# EAGLE design IR_tester_light (EAGLE 7.7.0)
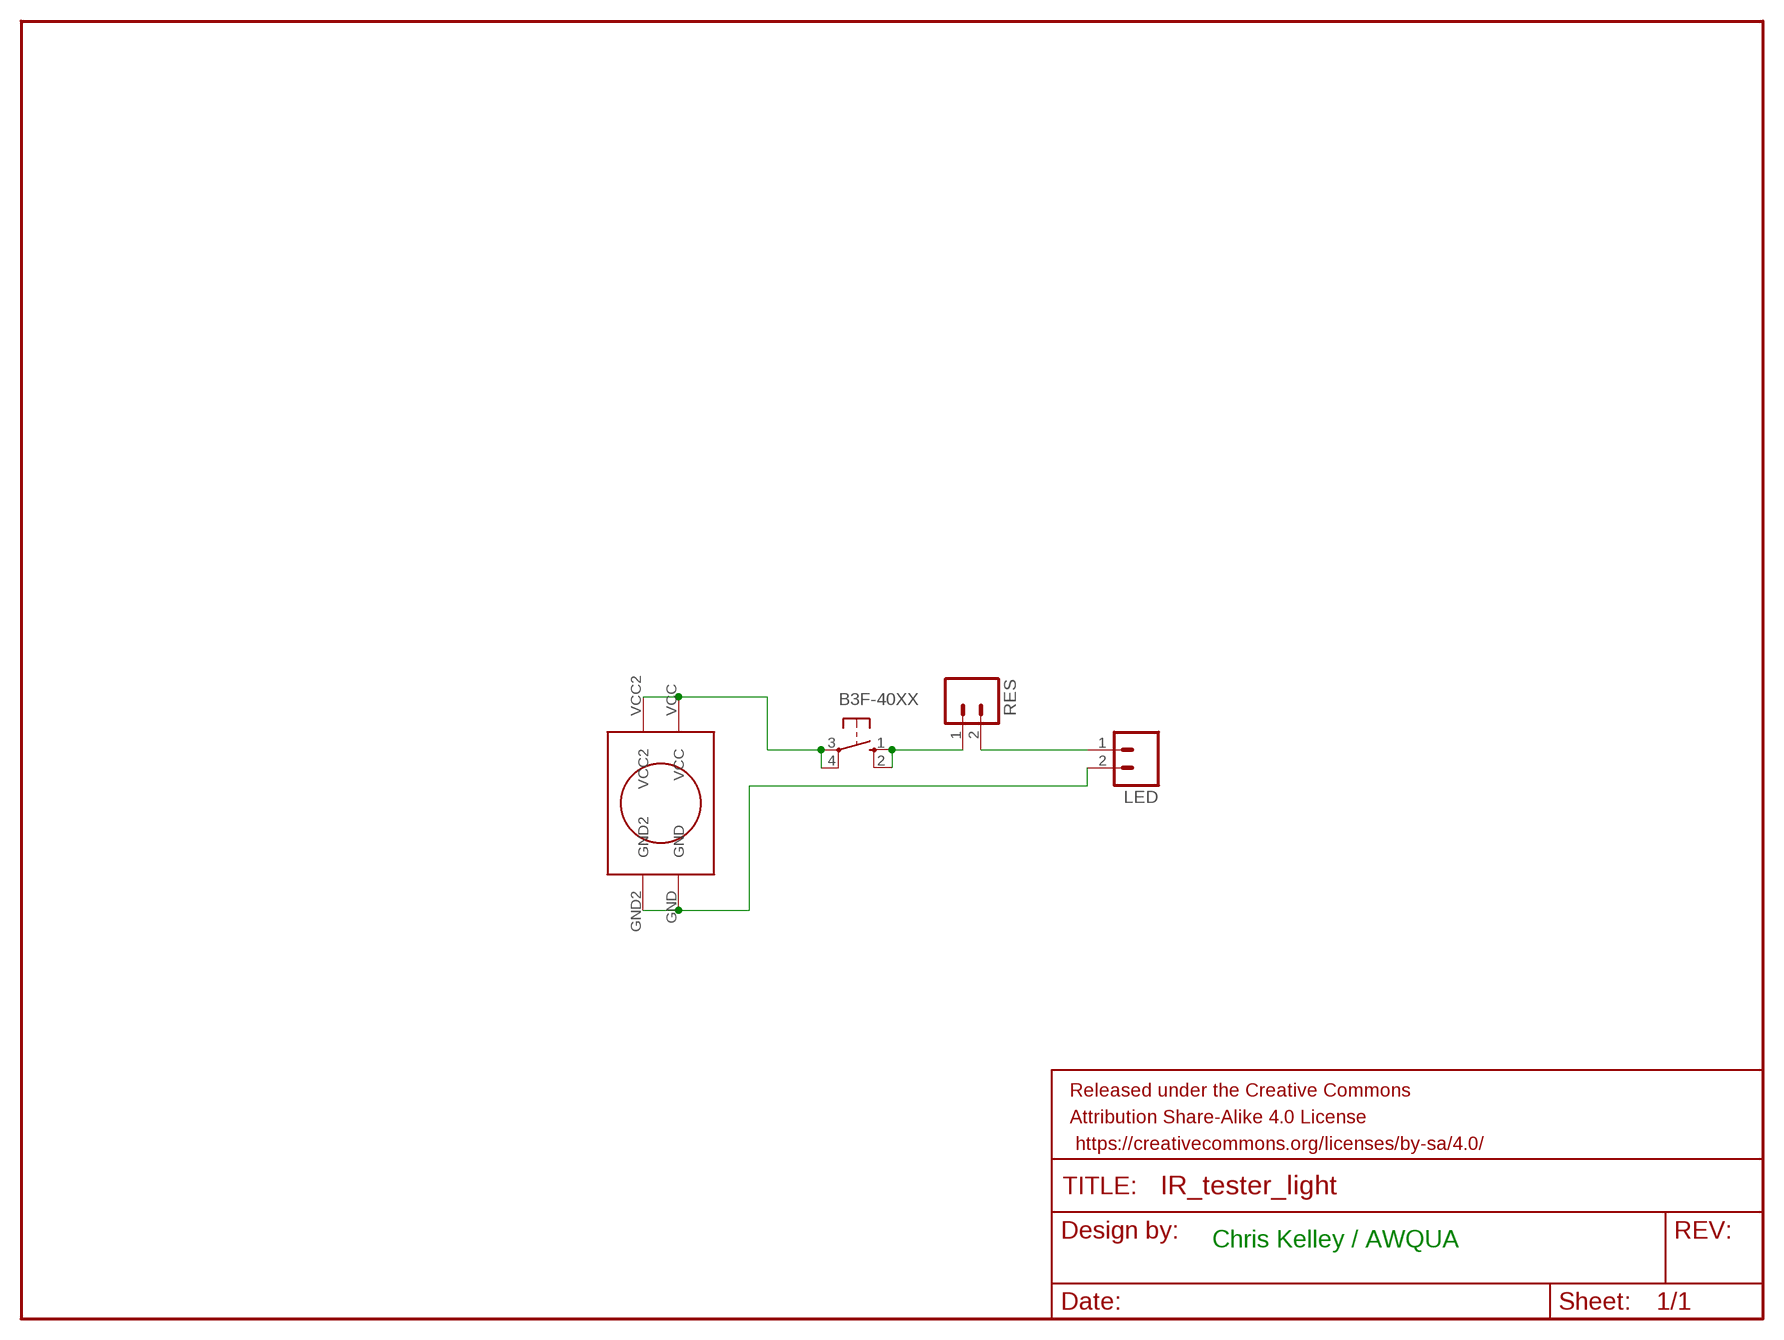
[diagram p0: schematic, sheet 1]

## Parts
B3F-40XX  40-XX  [B3F-40XX]
FRAME1  FRAME-LETTER  [CREATIVE_COMMONS]
LED  M02PTH  [1X02]
RES  M02PTH  [1X02]
U$1  CR1632-KEYSTYONE-3013  [CR1632-KEYSTYONE-3013]

## Nets
GND: LED.2 U$1.GND U$1.GND2
N$10: LED.1 RES.2
N$11: B3F-40XX.1(S) B3F-40XX.2(S1) RES.1
VCC: B3F-40XX.3(P) B3F-40XX.4(P1) U$1.VCC U$1.VCC2

## Notes on the sheet
- Chris Kelley / AWQUA

## Library data of the parts
B3F-40XX = adafruit:40-XX: OMRON SWITCH; MF: OMRON COMPONENTS USA; MPN: B3F-4000; OC_FARNELL: 176434; OC_NEWARK: 36K3105
FRAME1 = SparkFun-Aesthetics:FRAME-LETTER: Schematic Frame Standard 8.5x11 US Letter frame
LED RES = SparkFun-Connectors:M02: Standard 2-pin 0.1" header. Use with - straight break away headers ( PRT-00116) - right angle break away headers (PRT-00553) - swiss pins (PRT-00743) - machine pins (PRT-00117) - female headers (PRT-00115) Molex polarized connector foot print use with: PRT-08233 with associated crimp pins and housings. 2.54_SCREWTERM for use with PRT-10571. 3.5mm Screw Terminal footprints for PRT-08084 5mm Screw Terminal footprints for use with PRT-08432
U$1 = awqua_eagle_library:CR1632-KEYSTYONE-3013

## Board
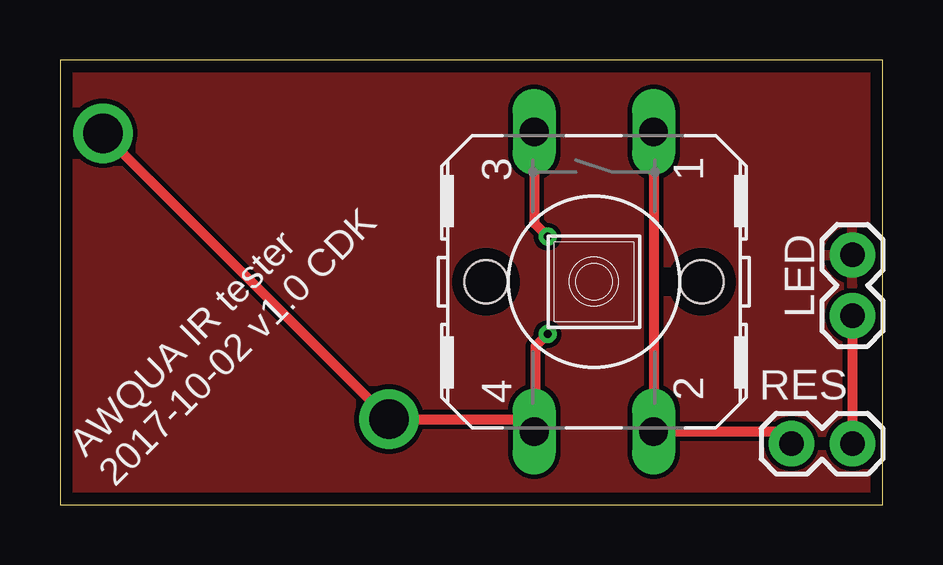
[diagram p1: board, top side]
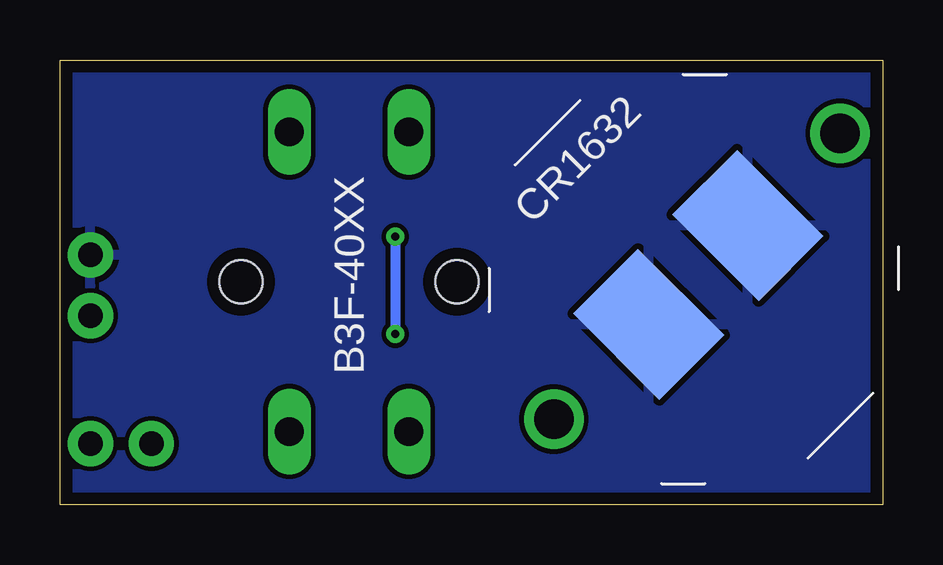
[diagram p2: board, bottom side, seen from below]

Size 34.29 x 18.54 mm. Coordinates in mm from the lower left corner, seen from the top.
Outline: 0,18.54 0,0 34.29,0 34.29,18.54 0,18.54
Copper layers (1*16): Top 0.035mm / dielectric 1.5mm / Bottom 0.035mm
Design rules "default *": minimum track width 8mil, minimum drill 12mil, track to track 8mil, track to pad 8mil, pad to pad 8mil, via to via 8mil, smd to smd 8mil, copper to edge 20mil, drill to drill 8mil, minimum pad ring 10mil, minimum via ring 8mil, stop-mask expansion 2mil, vias tented up to drill 13mil, thermal gap 10mil

### Footprints (pad centres in the part's own frame; a part is rotated, then mirrored left to right if it is on the bottom)
B3F-40XX = drill 1.194 long: 1 -6.248,2.489; 2 6.248,2.489; 3 -6.248,-2.489; 4 6.248,-2.489 | hole 1.803: 0,-4.496; 0,4.496
1X02 = drill 1.016 pad 1.88: 1 0,0; 2 2.54,0
CR1632-KEYSTYONE-3013 = smd 3.81 x 5.08: GND -2.921,0; GND2 2.921,0 | drill 1.651: VCC -8.509,0; VCC2 8.357,0

### Placement (x,y rotation side)
B3F-40XX  22.25,9.29 270 top
FRAME1  -8.13,-10.67 0 top  (outside the outline)
LED  33.02,7.87 90 top
RES  30.48,2.54 0 top
U$1  7.69,9.58 45 bottom

### Tracks (layer width: path | path; a pad name or v marks a point on that pad's centre or on a via)
GND
  pour Bottom: -5.33,42.16 71.37,43.69 70.61,-2.29 -5.84,-3.3
  pour Top: -4.06,40.89 72.39,41.91 71.88,-3.56 -4.57,-4.57
N$10
  Top 0.406: LED.1 RES.2
N$11
  Top 0.406: B3F-40XX.1 B3F-40XX.2 29.98,3.04 RES.1
VCC  (via drill 0.33)
  Top 0.406: U$1.VCC2 U$1.VCC 19.24,3.56 19.4,3.4 | 19.4,3.4 B3F-40XX.4 | B3F-40XX.3 19.76,11.74 v20.32,11.18 | v20.32,7.11 19.81,6.6 19.81,3.81 19.4,3.4
  Bottom 0.406: v20.32,11.18 v20.32,7.11

### Text on the board
tPlace: AWQUA IR tester / 2017-10-02 v1.0 CDK | Chris Kelley / AWQUA